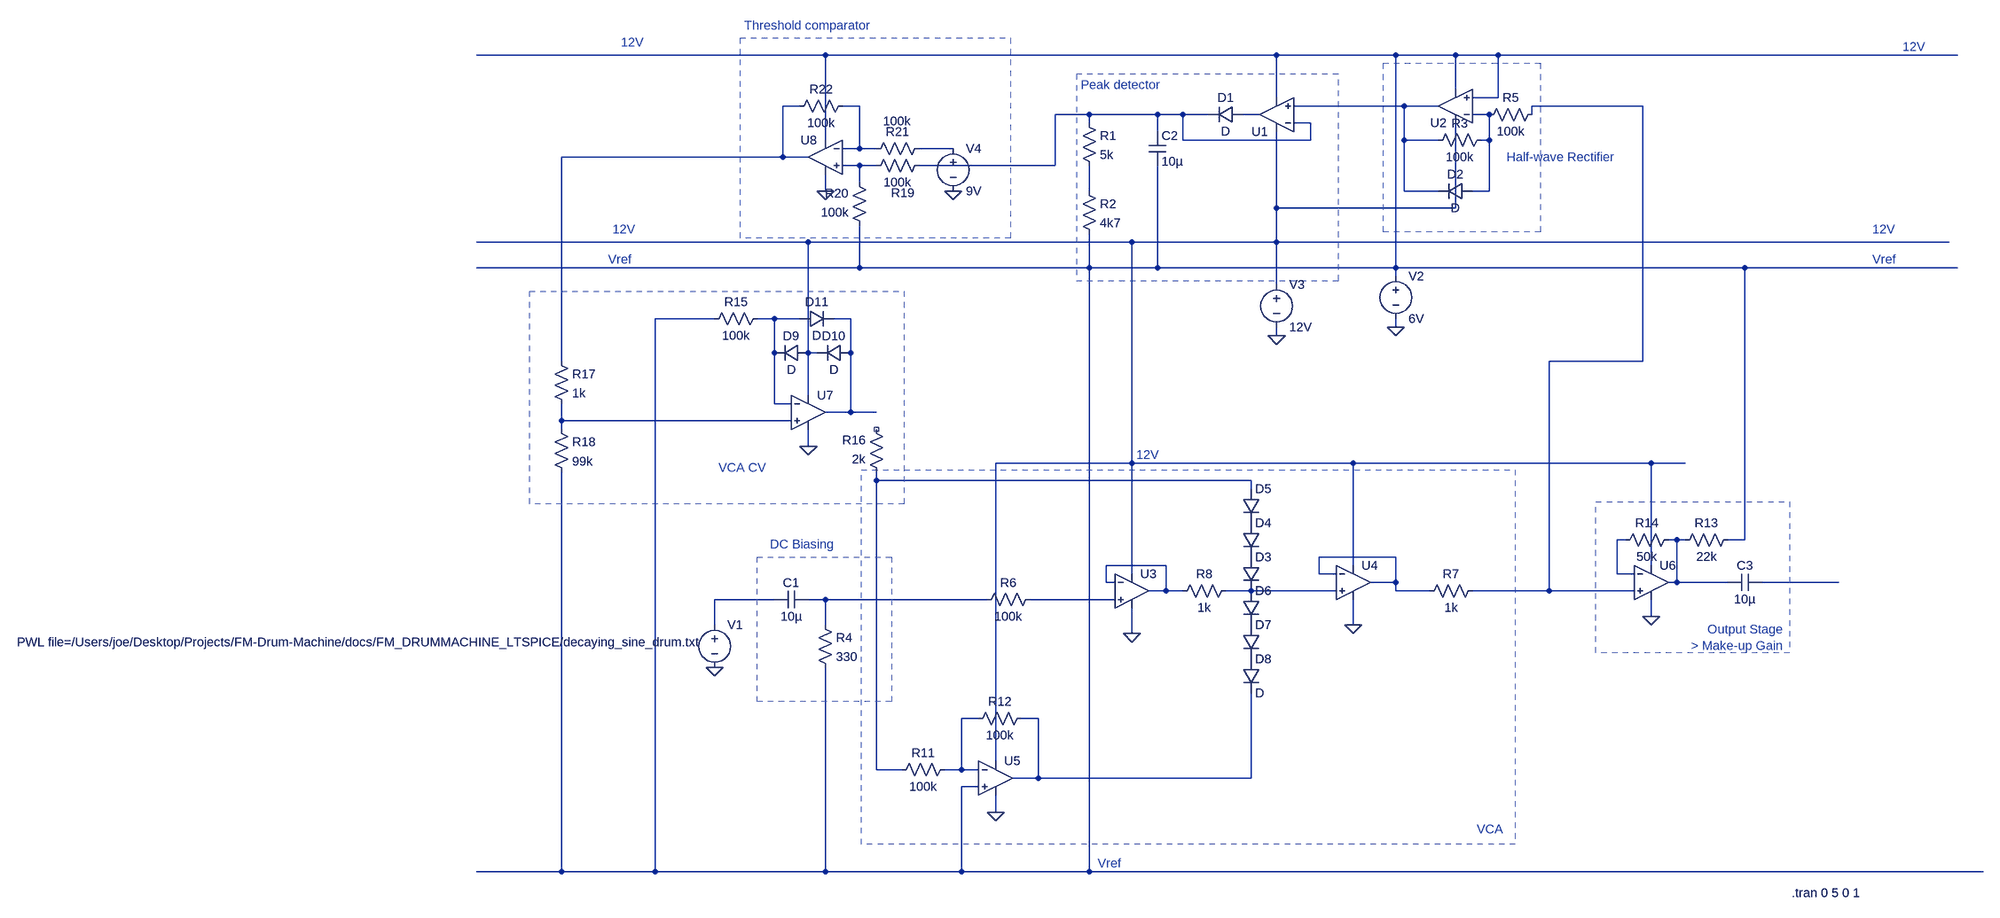
[diagram p0: schematic PEAK_DETECTOR_HALF-WAVE_RECTIFIER.asc]
PEAK_DETECTOR_HALF-WAVE_RECTIFIER.asc, the LTspice schematic file:
Version 4
SHEET 1 2108 1672
WIRE -752 80 -1408 80
WIRE 96 80 -752 80
WIRE 320 80 96 80
WIRE 432 80 320 80
WIRE 512 80 432 80
WIRE 1376 80 512 80
WIRE 432 144 432 80
WIRE 96 160 96 80
WIRE 512 160 512 80
WIRE 512 160 464 160
WIRE -800 176 -832 176
WIRE -688 176 -720 176
WIRE 336 176 128 176
WIRE 400 176 336 176
WIRE 784 176 576 176
WIRE -256 192 -320 192
WIRE -128 192 -256 192
WIRE -80 192 -128 192
WIRE -32 192 -80 192
WIRE 64 192 32 192
WIRE 496 192 464 192
WIRE 576 192 576 176
WIRE -256 208 -256 192
WIRE 160 208 128 208
WIRE -128 224 -128 192
WIRE -752 240 -752 80
WIRE -80 240 -80 192
WIRE 160 240 160 208
WIRE 160 240 -80 240
WIRE 336 240 336 176
WIRE 400 240 336 240
WIRE 496 240 496 192
WIRE 496 240 480 240
WIRE -688 256 -688 176
WIRE -688 256 -720 256
WIRE -656 256 -688 256
WIRE -512 256 -576 256
WIRE -832 272 -832 176
WIRE -832 272 -1248 272
WIRE -784 272 -832 272
WIRE -688 288 -720 288
WIRE -656 288 -688 288
WIRE -320 288 -320 192
WIRE -320 288 -576 288
WIRE -688 320 -688 288
WIRE -752 336 -752 304
WIRE -256 336 -256 288
WIRE 336 336 336 240
WIRE 400 336 336 336
WIRE 496 336 496 240
WIRE 496 336 464 336
WIRE 96 368 96 224
WIRE 432 368 432 208
WIRE 432 368 96 368
WIRE -784 432 -1408 432
WIRE -176 432 -784 432
WIRE 96 432 96 368
WIRE 96 432 -176 432
WIRE 1360 432 96 432
WIRE -688 480 -688 400
WIRE -688 480 -1408 480
WIRE -256 480 -256 416
WIRE -256 480 -688 480
WIRE -128 480 -128 288
WIRE -128 480 -256 480
WIRE 320 480 320 80
WIRE 320 480 -128 480
WIRE 976 480 320 480
WIRE 1376 480 976 480
WIRE 320 496 320 480
WIRE 96 512 96 432
WIRE -960 576 -1072 576
WIRE -848 576 -880 576
WIRE -800 576 -848 576
WIRE -704 576 -736 576
WIRE 320 592 320 576
WIRE 96 608 96 592
WIRE -848 640 -848 576
WIRE -784 640 -784 432
WIRE -768 640 -784 640
WIRE -704 640 -704 576
WIRE -1248 656 -1248 272
WIRE 784 656 784 176
WIRE 784 656 608 656
WIRE -784 720 -784 640
WIRE -848 736 -848 640
WIRE -816 736 -848 736
WIRE -704 752 -704 640
WIRE -704 752 -752 752
WIRE -656 752 -704 752
WIRE -1248 768 -1248 736
WIRE -816 768 -1248 768
WIRE -1248 784 -1248 768
WIRE -784 816 -784 784
WIRE -176 848 -176 432
WIRE -176 848 -432 848
WIRE 240 848 -176 848
WIRE 800 848 240 848
WIRE 864 848 800 848
WIRE -656 880 -656 864
WIRE 48 880 -656 880
WIRE 48 896 48 880
WIRE 752 992 736 992
WIRE 848 992 832 992
WIRE 864 992 848 992
WIRE 976 992 976 480
WIRE 976 992 944 992
WIRE 320 1024 176 1024
WIRE -112 1040 -224 1040
WIRE 240 1040 240 848
WIRE 800 1040 800 848
WIRE -176 1056 -176 848
WIRE 176 1056 176 1024
WIRE 208 1056 176 1056
WIRE 736 1056 736 992
WIRE 768 1056 736 1056
WIRE -224 1072 -224 1040
WIRE -208 1072 -224 1072
WIRE 320 1072 320 1024
WIRE 320 1072 272 1072
WIRE 848 1072 848 992
WIRE 848 1072 832 1072
WIRE 944 1072 848 1072
WIRE 1152 1072 1008 1072
WIRE -112 1088 -112 1040
WIRE -112 1088 -144 1088
WIRE -80 1088 -112 1088
WIRE 48 1088 0 1088
WIRE 208 1088 48 1088
WIRE 320 1088 320 1072
WIRE 384 1088 320 1088
WIRE 608 1088 608 656
WIRE 608 1088 464 1088
WIRE 768 1088 608 1088
WIRE -848 1104 -960 1104
WIRE -752 1104 -784 1104
WIRE -448 1104 -752 1104
WIRE -208 1104 -368 1104
WIRE 800 1136 800 1104
WIRE -960 1152 -960 1104
WIRE -752 1152 -752 1104
WIRE 240 1152 240 1104
WIRE -176 1168 -176 1120
WIRE -464 1328 -496 1328
WIRE -352 1328 -384 1328
WIRE -432 1408 -432 848
WIRE -656 1424 -656 880
WIRE -608 1424 -656 1424
WIRE -496 1424 -496 1328
WIRE -496 1424 -528 1424
WIRE -464 1424 -496 1424
WIRE -352 1440 -352 1328
WIRE -352 1440 -400 1440
WIRE 48 1440 48 1280
WIRE 48 1440 -352 1440
WIRE -464 1456 -496 1456
WIRE -432 1504 -432 1472
WIRE -1248 1616 -1248 864
WIRE -1248 1616 -1408 1616
WIRE -1072 1616 -1072 576
WIRE -1072 1616 -1248 1616
WIRE -752 1616 -752 1232
WIRE -752 1616 -1072 1616
WIRE -496 1616 -496 1456
WIRE -496 1616 -752 1616
WIRE -256 1616 -256 480
WIRE -256 1616 -496 1616
WIRE 1424 1616 -256 1616
FLAG 320 592 0
FLAG -960 1232 0
FLAG 96 608 0
FLAG -176 1168 0
FLAG 240 1152 0
FLAG -432 1504 0
FLAG 800 1136 0
FLAG -784 816 0
FLAG -752 336 0
FLAG -512 336 0
SYMBOL voltage -960 1136 R0
WINDOW 3 -1311 48 Left 2
SYMATTR Value PWL file=/Users/joe/Desktop/Projects/FM-Drum-Machine/docs/FM_DRUMMACHINE_LTSPICE/decaying_sine_drum.txt
SYMATTR InstName V1
SYMBOL OpAmps/UniversalOpAmp 96 192 R180
SYMATTR InstName U1
SYMBOL OpAmps/UniversalOpAmp 432 176 R180
SYMATTR InstName U2
SYMBOL voltage 320 480 R0
SYMATTR InstName V2
SYMATTR Value 6V
SYMBOL voltage 96 496 R0
SYMATTR InstName V3
SYMATTR Value 12V
SYMBOL Diode 32 176 R90
WINDOW 0 0 32 VBottom 2
WINDOW 3 32 32 VTop 2
SYMATTR InstName D1
SYMBOL Res -768 1136 R0
SYMATTR InstName R4
SYMATTR Value 330
SYMBOL Cap -784 1088 R90
WINDOW 0 0 32 VBottom 2
WINDOW 3 32 32 VTop 2
SYMATTR InstName C1
SYMATTR Value 10µ
SYMBOL Cap -144 224 R0
SYMATTR InstName C2
SYMATTR Value 10µ
SYMBOL Res -272 192 R0
SYMATTR InstName R1
SYMATTR Value 5k
SYMBOL Res -272 320 R0
SYMATTR InstName R2
SYMATTR Value 4k7
SYMBOL Res 496 224 R90
WINDOW 0 0 56 VBottom 2
WINDOW 3 32 56 VTop 2
SYMATTR InstName R3
SYMATTR Value 100k
SYMBOL Res 592 176 R90
WINDOW 0 0 56 VBottom 2
WINDOW 3 32 56 VTop 2
SYMATTR InstName R5
SYMATTR Value 100k
SYMBOL Diode 464 320 R90
WINDOW 0 0 32 VBottom 2
WINDOW 3 32 32 VTop 2
SYMATTR InstName D2
SYMBOL Res -352 1088 R90
WINDOW 0 0 56 VBottom 2
WINDOW 3 32 56 VTop 2
SYMATTR InstName R6
SYMATTR Value 100k
SYMBOL OpAmps/UniversalOpAmp -176 1088 R0
SYMATTR InstName U3
SYMBOL OpAmps/UniversalOpAmp 240 1072 R0
SYMATTR InstName U4
SYMBOL OpAmps/UniversalOpAmp -432 1440 R0
SYMATTR InstName U5
SYMBOL Res 16 1072 R90
WINDOW 0 0 56 VBottom 2
WINDOW 3 32 56 VTop 2
SYMATTR InstName R8
SYMATTR Value 1k
SYMBOL Diode 32 1024 R0
SYMATTR InstName D3
SYMBOL Diode 32 960 R0
SYMATTR InstName D4
SYMBOL Diode 32 896 R0
SYMATTR InstName D5
SYMBOL Diode 32 1088 R0
SYMATTR InstName D6
SYMBOL Diode 32 1152 R0
SYMATTR InstName D7
SYMBOL Diode 32 1216 R0
SYMATTR InstName D8
SYMBOL Res -512 1408 R90
WINDOW 0 0 56 VBottom 2
WINDOW 3 32 56 VTop 2
SYMATTR InstName R11
SYMATTR Value 100k
SYMBOL Res -368 1312 R90
WINDOW 0 0 56 VBottom 2
WINDOW 3 32 56 VTop 2
SYMATTR InstName R12
SYMATTR Value 100k
SYMBOL Cap 1008 1056 R90
WINDOW 0 0 32 VBottom 2
WINDOW 3 32 32 VTop 2
SYMATTR InstName C3
SYMATTR Value 10µ
SYMBOL OpAmps/UniversalOpAmp 800 1072 R0
SYMATTR InstName U6
SYMBOL Res 960 976 R90
WINDOW 0 0 56 VBottom 2
WINDOW 3 32 56 VTop 2
SYMATTR InstName R13
SYMATTR Value 22k
SYMBOL Res 848 976 R90
WINDOW 0 0 56 VBottom 2
WINDOW 3 32 56 VTop 2
SYMATTR InstName R14
SYMATTR Value 50k
SYMBOL OpAmps/UniversalOpAmp -784 752 R0
SYMATTR InstName U7
SYMBOL OpAmps/UniversalOpAmp -752 272 M0
SYMATTR InstName U8
SYMBOL Diode -784 624 R90
WINDOW 0 0 32 VBottom 2
WINDOW 3 32 32 VTop 2
SYMATTR InstName D9
SYMBOL Diode -704 624 R90
WINDOW 0 0 32 VBottom 2
WINDOW 3 32 32 VTop 2
SYMATTR InstName D10
SYMBOL Diode -800 592 R270
WINDOW 0 32 32 VTop 2
WINDOW 3 0 32 VBottom 2
SYMATTR InstName D11
SYMBOL Res -864 560 R90
WINDOW 0 0 56 VBottom 2
WINDOW 3 32 56 VTop 2
SYMATTR InstName R15
SYMATTR Value 100k
SYMBOL Res -640 880 R180
WINDOW 0 36 76 Left 2
WINDOW 3 36 40 Left 2
SYMATTR InstName R16
SYMATTR Value 2k
SYMBOL Res -1264 768 R0
SYMATTR InstName R18
SYMATTR Value 99k
SYMBOL Res -560 272 R90
WINDOW 0 83 46 VBottom 2
WINDOW 3 32 56 VTop 2
SYMATTR InstName R19
SYMATTR Value 100k
SYMBOL Res -672 416 R180
WINDOW 0 36 76 Left 2
WINDOW 3 36 40 Left 2
SYMATTR InstName R20
SYMATTR Value 100k
SYMBOL Res -560 240 R90
WINDOW 0 0 56 VBottom 2
WINDOW 3 -51 57 VTop 2
SYMATTR InstName R21
SYMATTR Value 100k
SYMBOL Res -704 160 R90
WINDOW 0 0 56 VBottom 2
WINDOW 3 32 56 VTop 2
SYMATTR InstName R22
SYMATTR Value 100k
SYMBOL Res -1264 640 R0
SYMATTR InstName R17
SYMATTR Value 1k
SYMBOL voltage -512 240 R0
SYMATTR InstName V4
SYMATTR Value 9V
SYMBOL Res 480 1072 R90
WINDOW 0 0 56 VBottom 2
WINDOW 3 32 56 VTop 2
SYMATTR InstName R7
SYMATTR Value 1k
TEXT 1064 1656 Left 2 !.tran 0 5 0 1
TEXT 528 272 Left 2 ;Half-wave Rectifier
TEXT -272 136 Left 2 ;Peak detector
TEXT -856 1000 Left 2 ;DC Biasing
TEXT 1216 464 Left 2 ;Vref
TEXT -168 832 Left 2 ;12V
TEXT -240 1600 Left 2 ;Vref
TEXT 472 1536 Left 2 ;VCA
TEXT 1048 1160 Right 2 ;Output Stage\n> Make-up Gain
TEXT -864 856 Right 2 ;VCA CV
TEXT 1216 408 Left 2 ;12V
TEXT -1152 408 Left 2 ;12V
TEXT -1160 464 Left 2 ;Vref
TEXT 1272 64 Left 2 ;12V
TEXT -1136 56 Left 2 ;12V
TEXT -904 24 Left 2 ;Threshold comparator
RECTANGLE Normal 212 116 -280 504 2
RECTANGLE Normal 592 96 296 412 2
RECTANGLE Normal -880 1024 -628 1296 2
RECTANGLE Normal -684 860 544 1564 2
RECTANGLE Normal 696 920 1060 1204 2
RECTANGLE Normal -1308 524 -604 924 2
RECTANGLE Normal -912 48 -404 424 2

The netlist it stands for:
* PEAK_DETECTOR_HALF-WAVE_RECTIFIER.asc
V1 N023 0 PWL file=/Users/joe/Desktop/Projects/FM-Drum-Machine/docs/FM_DRUMMACHINE_LTSPICE/decaying_sine_drum.txt
XU1 N004 N006 N012 N001 N007 level1 Avol=1Meg GBW=10Meg Vos=0 En=0 Enk=0 In=0 Ink=0 Rin=500Meg  ; pins In+ In- V+ V- OUT
XU2 N001 N008 N012 N001 N004 level1 Avol=1Meg GBW=10Meg Vos=0 En=0 Enk=0 In=0 Ink=0 Rin=500Meg  ; pins In+ In- V+ V- OUT
V2 N001 0 6V
V3 N012 0 12V
D1 N007 N006 D
R4 N024 N001 330
C1 N024 N023 10µ
C2 N006 N001 10µ
R1 N006 N011 5k
R2 N011 N001 4k7
R3 N008 N004 100k
R5 N005 N008 100k
D2 N008 N004 D
R6 N025 N024 100k
XU3 N025 N020 N012 0 N020 level1 Avol=1Meg GBW=10Meg Vos=0 En=0 Enk=0 In=0 Ink=0 Rin=500Meg  ; pins In+ In- V+ V- OUT
XU4 N022 N019 N012 0 N019 level1 Avol=1Meg GBW=10Meg Vos=0 En=0 Enk=0 In=0 Ink=0 Rin=500Meg  ; pins In+ In- V+ V- OUT
XU5 N001 N026 N012 0 N027 level1 Avol=1Meg GBW=10Meg Vos=0 En=0 Enk=0 In=0 Ink=0 Rin=500Meg  ; pins In+ In- V+ V- OUT
R8 N022 N020 1k
D3 P001 N022 D
D4 P002 P001 D
D5 N016 P002 D
D6 N022 P003 D
D7 P003 P004 D
D8 P004 N027 D
R11 N026 N016 100k
R12 N027 N026 100k
C3 N021 N018 10µ
XU6 N005 N017 N012 0 N018 level1 Avol=1Meg GBW=10Meg Vos=0 En=0 Enk=0 In=0 Ink=0 Rin=500Meg  ; pins In+ In- V+ V- OUT
R13 N001 N018 22k
R14 N018 N017 50k
XU7 N015 N013 N012 0 N014 level1 Avol=1Meg GBW=10Meg Vos=0 En=0 Enk=0 In=0 Ink=0 Rin=500Meg  ; pins In+ In- V+ V- OUT
XU8 N010 N003 N001 0 N002 level1 Avol=1Meg GBW=10Meg Vos=0 En=0 Enk=0 In=0 Ink=0 Rin=500Meg  ; pins In+ In- V+ V- OUT
D9 N012 N013 D
D10 N014 N012 D
D11 N013 N014 D
R15 N013 N001 100k
R16 N016 NC_01 2k
R18 N015 N001 99k
R19 N006 N010 100k
R20 N001 N010 100k
R21 N009 N003 100k
R22 N003 N002 100k
R17 N002 N015 1k
V4 N009 0 9V
R7 N005 N019 1k
.model D D
.lib standard.dio
.tran 0 5 0 1
* Half-wave Rectifier
* Peak detector
* DC Biasing
* Vref
* 12V
* Vref
* VCA
* Output Stage
* > Make-up Gain
* VCA CV
* 12V
* 12V
* Vref
* 12V
* 12V
* Threshold comparator
.lib UniversalOpAmp1.lib
.backanno
.end